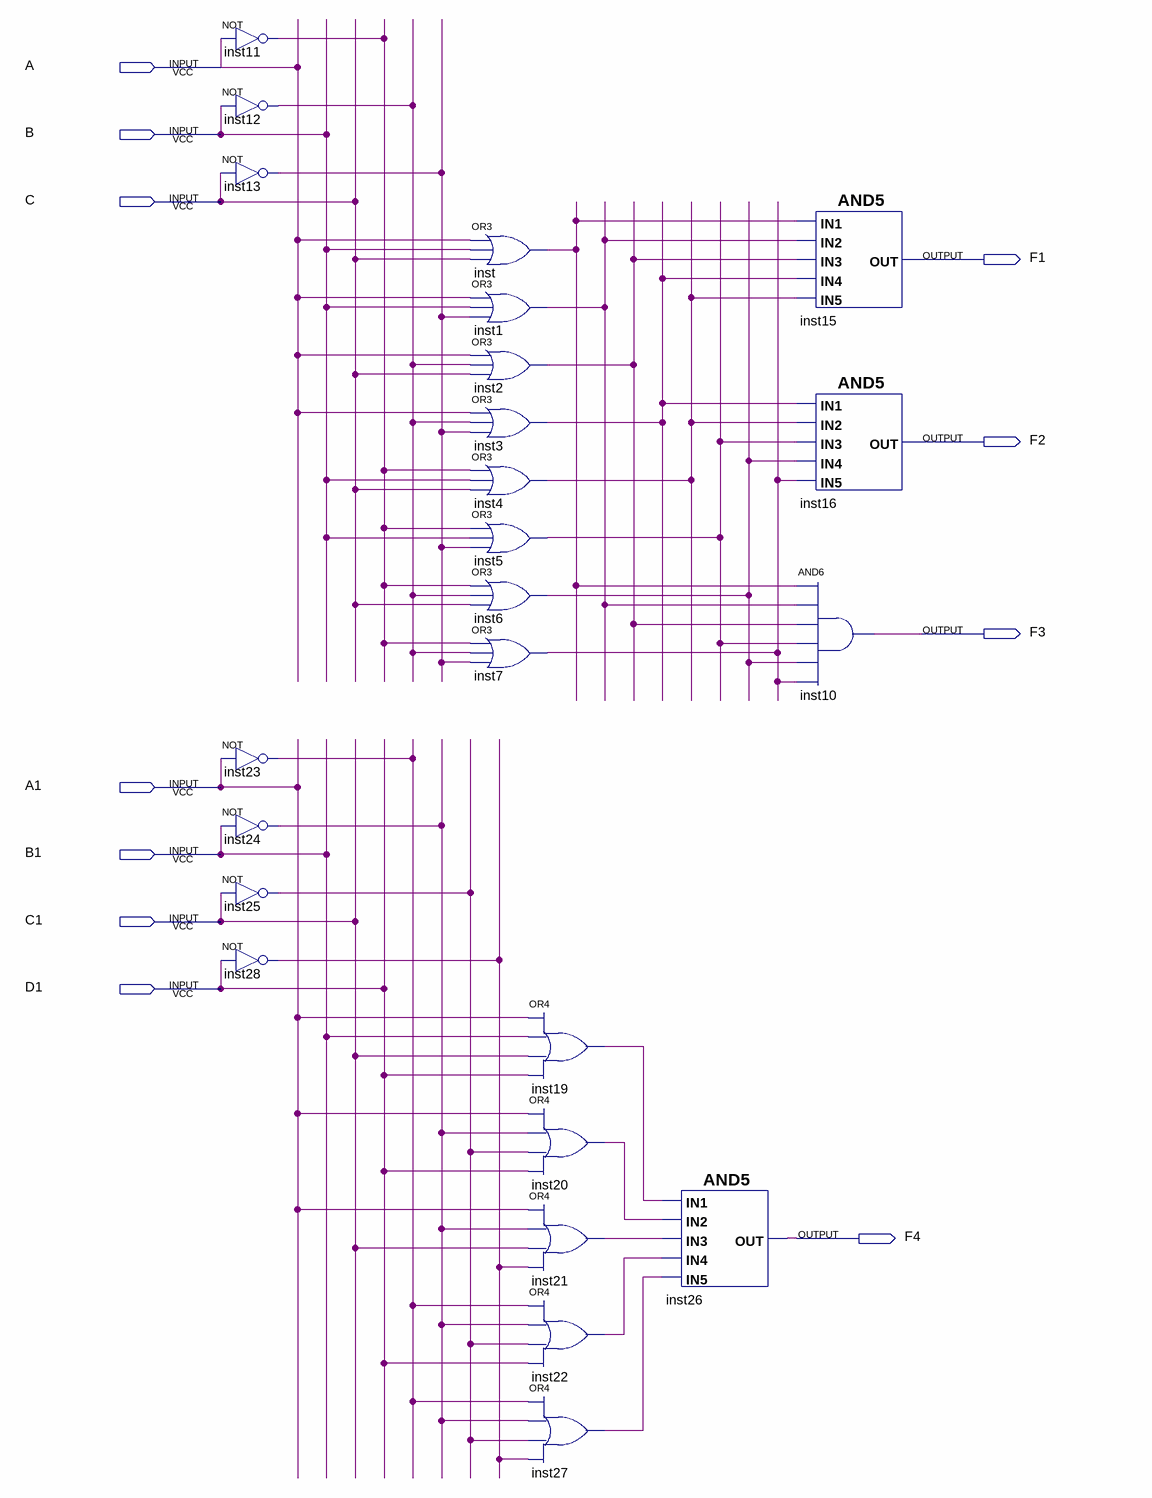
[diagram p0: schematic sheet]
// Quartus schematic voting_circuit_2.bdf as structural Verilog: 24 symbols, 11 pins
module voting_circuit_2 (
  input  A,
  input  B,
  input  C,
  input  A1,
  input  B1,
  input  C1,
  input  D1,
  output F1,
  output F2,
  output F3,
  output F4
);

  wire inst1_out, inst2_out, inst3_out, inst4_out, inst5_out, inst6_out, inst7_out, inst11_out, inst12_out,
       inst13_out, inst19_out, inst20_out, inst21_out, inst22_out, inst23_out, inst24_out, inst25_out,
       inst27_out, inst28_out, inst_out;

  not inst11 (inst11_out, A);
  not inst12 (inst12_out, B);
  not inst13 (inst13_out, C);
  not inst23 (inst23_out, A1);
  not inst24 (inst24_out, B1);
  not inst25 (inst25_out, C1);
  not inst28 (inst28_out, D1);
  or inst (inst_out, A, B, C);
  or inst1 (inst1_out, A, B, inst13_out);
  or inst2 (inst2_out, A, inst12_out, C);
  or inst3 (inst3_out, A, inst12_out, inst13_out);
  or inst4 (inst4_out, inst11_out, B, C);
  or inst5 (inst5_out, inst11_out, B, inst13_out);
  or inst6 (inst6_out, inst11_out, inst12_out, C);
  or inst7 (inst7_out, inst11_out, inst12_out, inst13_out);
  or inst19 (inst19_out, A1, B1, C1, D1);
  or inst20 (inst20_out, A1, inst24_out, inst25_out, D1);
  or inst21 (inst21_out, A1, inst24_out, C1, inst28_out);
  or inst22 (inst22_out, inst23_out, inst24_out, inst25_out, D1);
  or inst27 (inst27_out, inst23_out, inst24_out, inst25_out, inst28_out);
  and inst26 (F4, inst19_out, inst20_out, inst21_out, inst22_out, inst27_out);
  and inst15 (F1, inst_out, inst1_out, inst2_out, inst3_out, inst4_out);
  and inst16 (F2, inst3_out, inst4_out, inst5_out, inst6_out, inst7_out);
  and inst10 (F3, inst_out, inst1_out, inst2_out, inst5_out, inst6_out, inst7_out);
endmodule
